# Altium schematic sheet 原理图.SchDoc
size A4
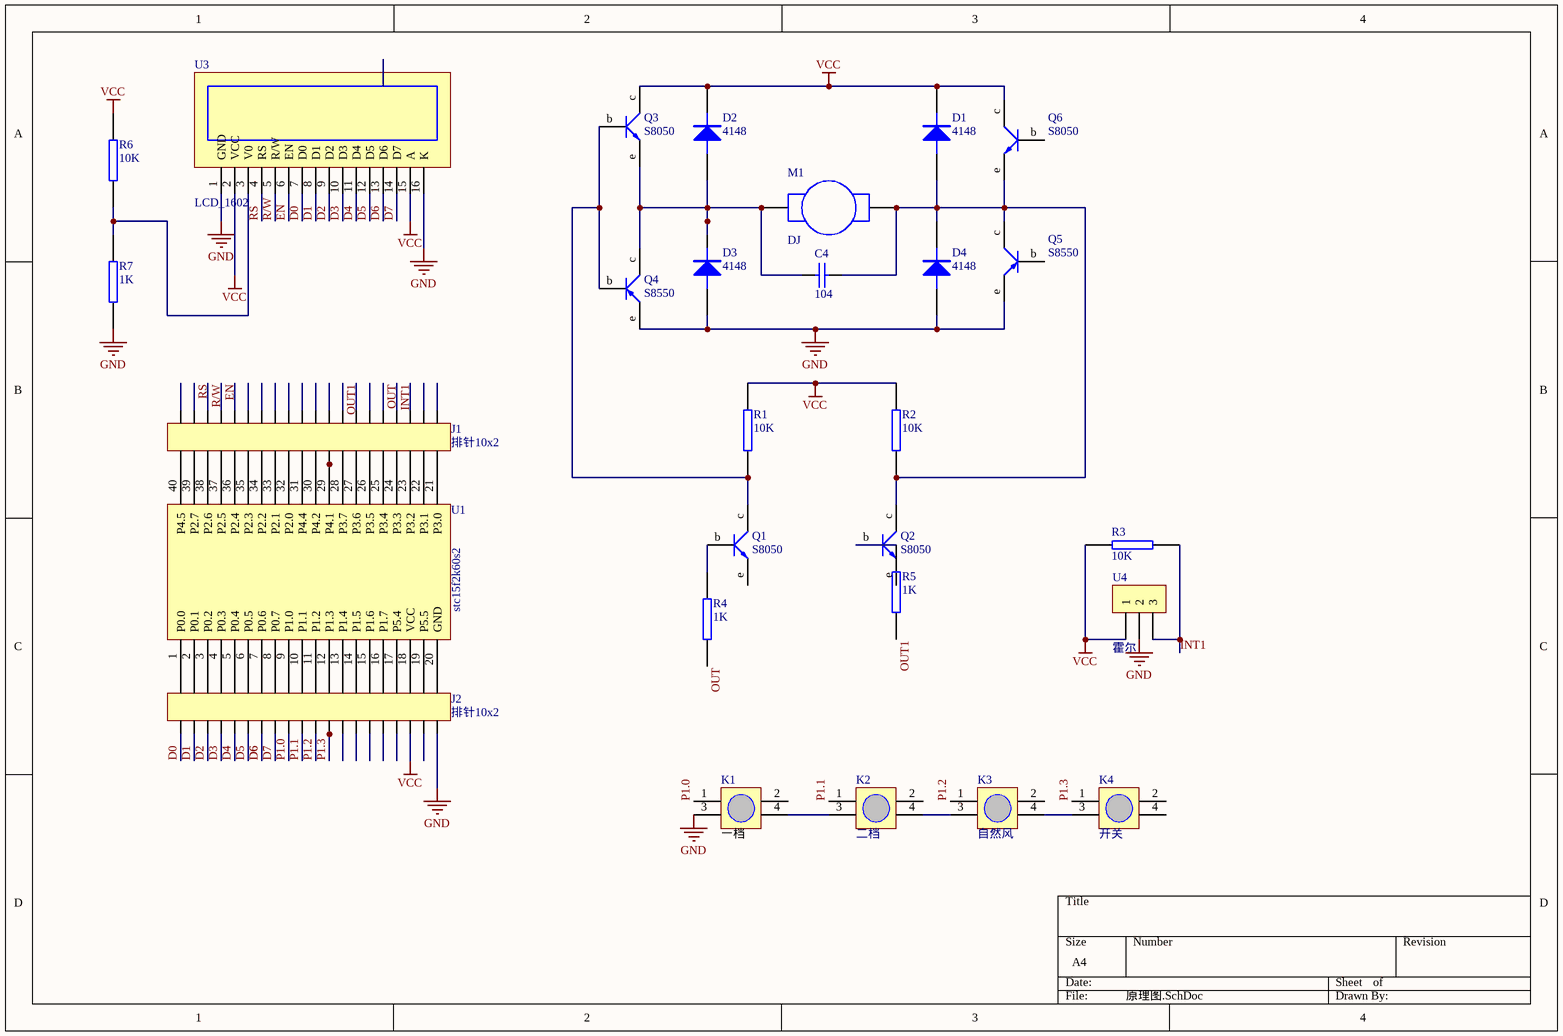
[diagram p0: 原理图.SchDoc]

## Parts
C4  104  [C01]
D1  4148  [DIODE0.2]
D2  4148  [DIODE0.2]
D3  4148  [DIODE0.2]
D4  4148  [DIODE0.2]
J1  排针10x2
J2  排针10x2
K1  一档  [KEY]
K2  二档  [KEY]
K3  自然风  [KEY]
K4  开关  [KEY]
M1  DJ  [SIP2]
Q1  S8050  [PNP]
Q2  S8050  [PNP]
Q3  S8050  [PNP]
Q4  S8550  [PNP]
Q5  S8550  [PNP]
Q6  S8050  [PNP]
R1  10K  [R-DIP]
R2  10K  [R-DIP]
R3  10K  [R-DIP]
R4  1K  [R-DIP]
R5  1K  [R-DIP]
R6  10K  [R-DIP]
R7  1K  [R-DIP]
U1  stc15f2k60s2
U3  LCD_1602  [SIP16]
U4  霍尔  [SIP3]

## Nets
GND: D3.1(A) D4.1(A) J2.2 K1.3 Q4.e Q5.e R7.2 U3.1(GND) U3.16(K) U4.2
VCC: D1.2(K) D2.2(K) J2.1 Q3.c Q6.c R1.1 R2.1 R3.1 R6.1 U3.2(VCC) U3.15(A) U4.1
D0: J2.1 U3.7(D0)
D1: J2.2 U3.8(D1)
D2: J2.2 U3.9(D2)
D3: J2.2 U3.10(D3)
D4: J2.2 U3.11(D4)
D5: J2.2 U3.12(D5)
D6: J2.1 U3.13(D6)
D7: J2.2 U3.14(D7)
EN: J1.3 U3.6(EN)
INT1: J1.3 R3.2 U4.3
OUT: J1.3 R4.2
OUT1: J1.2 R5.2
P1.0: J2.2 K1.1
P1.1: J2.2 K2.1
P1.2: J2.2 K3.1
P1.3: J2.1 J2.2 K4.1
R/W: J1.2 U3.5(R/W)
RS: J1.3 U3.4(RS)
NetC4_1: C4.1 D2.1(A) D3.2(K) M1.1 Q3.e Q4.c
NetC4_2: C4.2 D1.1(A) D4.2(K) M1.2 Q2.c Q5.c Q6.e R2.2
NetJ1_1: J1.1 U1.40(P4.5)
NetJ1_1: J1.1 U1.23(P3.2)  [a separate net that carries the same name]
NetJ1_1: J1.1 J1.2 U1.29(P4.1)  [a separate net that carries the same name]
NetJ1_1: J1.1 U1.34(P2.2)  [a separate net that carries the same name]
NetJ1_2: J1.2 U1.21(P3.0)
NetJ1_2: J1.2 U1.22(P3.1)  [a separate net that carries the same name]
NetJ1_2: J1.2 U1.24(P3.3)  [a separate net that carries the same name]
NetJ1_2: J1.2 U1.25(P3.4)  [a separate net that carries the same name]
NetJ1_2: J1.2 U1.26(P3.5)  [a separate net that carries the same name]
NetJ1_2: J1.2 U1.27(P3.6)  [a separate net that carries the same name]
NetJ1_2: J1.2 U1.28(P3.7)  [a separate net that carries the same name]
NetJ1_2: J1.2 U1.30(P4.2)  [a separate net that carries the same name]
NetJ1_2: J1.2 U1.31(P4.4)  [a separate net that carries the same name]
NetJ1_2: J1.2 U1.32(P2.0)  [a separate net that carries the same name]
NetJ1_2: J1.2 U1.33(P2.1)  [a separate net that carries the same name]
NetJ1_2: J1.2 U1.35(P2.3)  [a separate net that carries the same name]
NetJ1_2: J1.2 U1.36(P2.4)  [a separate net that carries the same name]
NetJ1_2: J1.2 U1.37(P2.5)  [a separate net that carries the same name]
NetJ1_2: J1.2 U1.38(P2.6)  [a separate net that carries the same name]
NetJ1_2: J1.2 U1.39(P2.7)  [a separate net that carries the same name]
NetJ2_2: J2.2 U1.1(P0.0)
NetJ2_2: J2.2 U1.3(P0.2)  [a separate net that carries the same name]
NetJ2_2: J2.2 U1.5(P0.4)  [a separate net that carries the same name]
NetJ2_2: J2.2 U1.7(P0.6)  [a separate net that carries the same name]
NetJ2_2: J2.2 U1.9(P1.0)  [a separate net that carries the same name]
NetJ2_2: J2.2 U1.11(P1.2)  [a separate net that carries the same name]
NetJ2_2: J2.2 U1.13(P1.4)  [a separate net that carries the same name]
NetJ2_2: J2.2 U1.15(P1.6)  [a separate net that carries the same name]
NetJ2_2: J2.2 U1.18(VCC)  [a separate net that carries the same name]
NetJ2_2: J2.2 U1.20(GND)  [a separate net that carries the same name]
NetJ2_3: J2.3 U1.2(P0.1)
NetJ2_3: J2.3 U1.4(P0.3)  [a separate net that carries the same name]
NetJ2_3: J2.3 U1.6(P0.5)  [a separate net that carries the same name]
NetJ2_3: J2.3 U1.8(P0.7)  [a separate net that carries the same name]
NetJ2_3: J2.3 U1.10(P1.1)  [a separate net that carries the same name]
NetJ2_3: J2.3 U1.12(P1.3)  [a separate net that carries the same name]
NetJ2_3: J2.3 U1.14(P1.5)  [a separate net that carries the same name]
NetJ2_3: J2.3 U1.16(P1.7)  [a separate net that carries the same name]
NetJ2_3: J2.3 U1.17(P5.4)  [a separate net that carries the same name]
NetJ2_3: J2.3 U1.19(P5.5)  [a separate net that carries the same name]
NetK1_4: K1.4 K2.3
NetK2_4: K2.4 K3.3
NetK3_4: K3.4 K4.3
NetQ1_b: Q1.b R4.1
NetQ1_c: Q1.c Q3.b Q4.b R1.2
NetQ2_b: Q2.b R5.1
NetR6_2: R6.2 R7.1 U3.3(V0)

Not connected (* = marked no-connect by the designer): K1 2; K2 2; K3 2; K4 2 4; Q1 e; Q2 e; Q5 b; Q6 b

## Library data of the parts
C4 = CAP: Capacitor
D1-D4 = DIODE
K1-K4 = KEY
M1 = MOTOR AC
Q1-Q3 Q6 = NPN
Q4 Q5 = PNP
R1-R7 = RES2
U3 = LCM1602
U4 = CON3: Connector